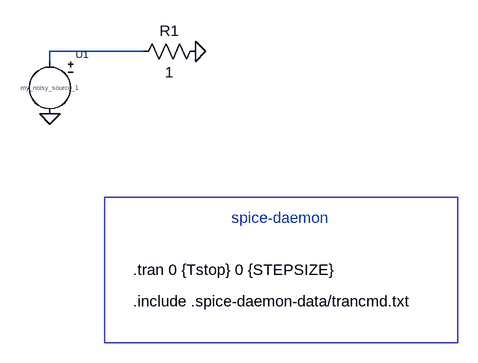
[diagram p0: schematic init.asc]
init.asc, the LTspice schematic file:
Version 4
SHEET 1 880 680
WIRE 256 288 112 288
WIRE 112 304 112 288
FLAG 112 384 0
FLAG 336 288 0
SYMBOL Res 352 272 R90
WINDOW 0 0 56 VBottom 2
WINDOW 3 32 56 VTop 2
SYMATTR InstName R1
SYMATTR Value 1
SYMBOL my_noisy_source_1 112 304 R0
SYMATTR InstName U1
TEXT 240 672 Left 2 !.include .spice-daemon-data/trancmd.txt
TEXT 392 544 Left 2 ;spice-daemon
TEXT 240 624 Left 2 !.tran 0 {Tstop} 0 {STEPSIZE}
RECTANGLE Normal 740 736 196 512 2�

The netlist it stands for:
* init.asc
R1 0 N001 1
XU1 N001 0 my_noisy_source_1  ; pins in out
.include .spice-daemon-data/trancmd.txt
* spice-daemon
.tran 0 {Tstop} 0 {STEPSIZE}
.lib /Users/torque/programs/spice-daemon/test2/.spice-daemon-data/spice-daemon.lib
.backanno
.end